# EasyEDA Pro project motorko_cryo_drake.eprj, board PCB1
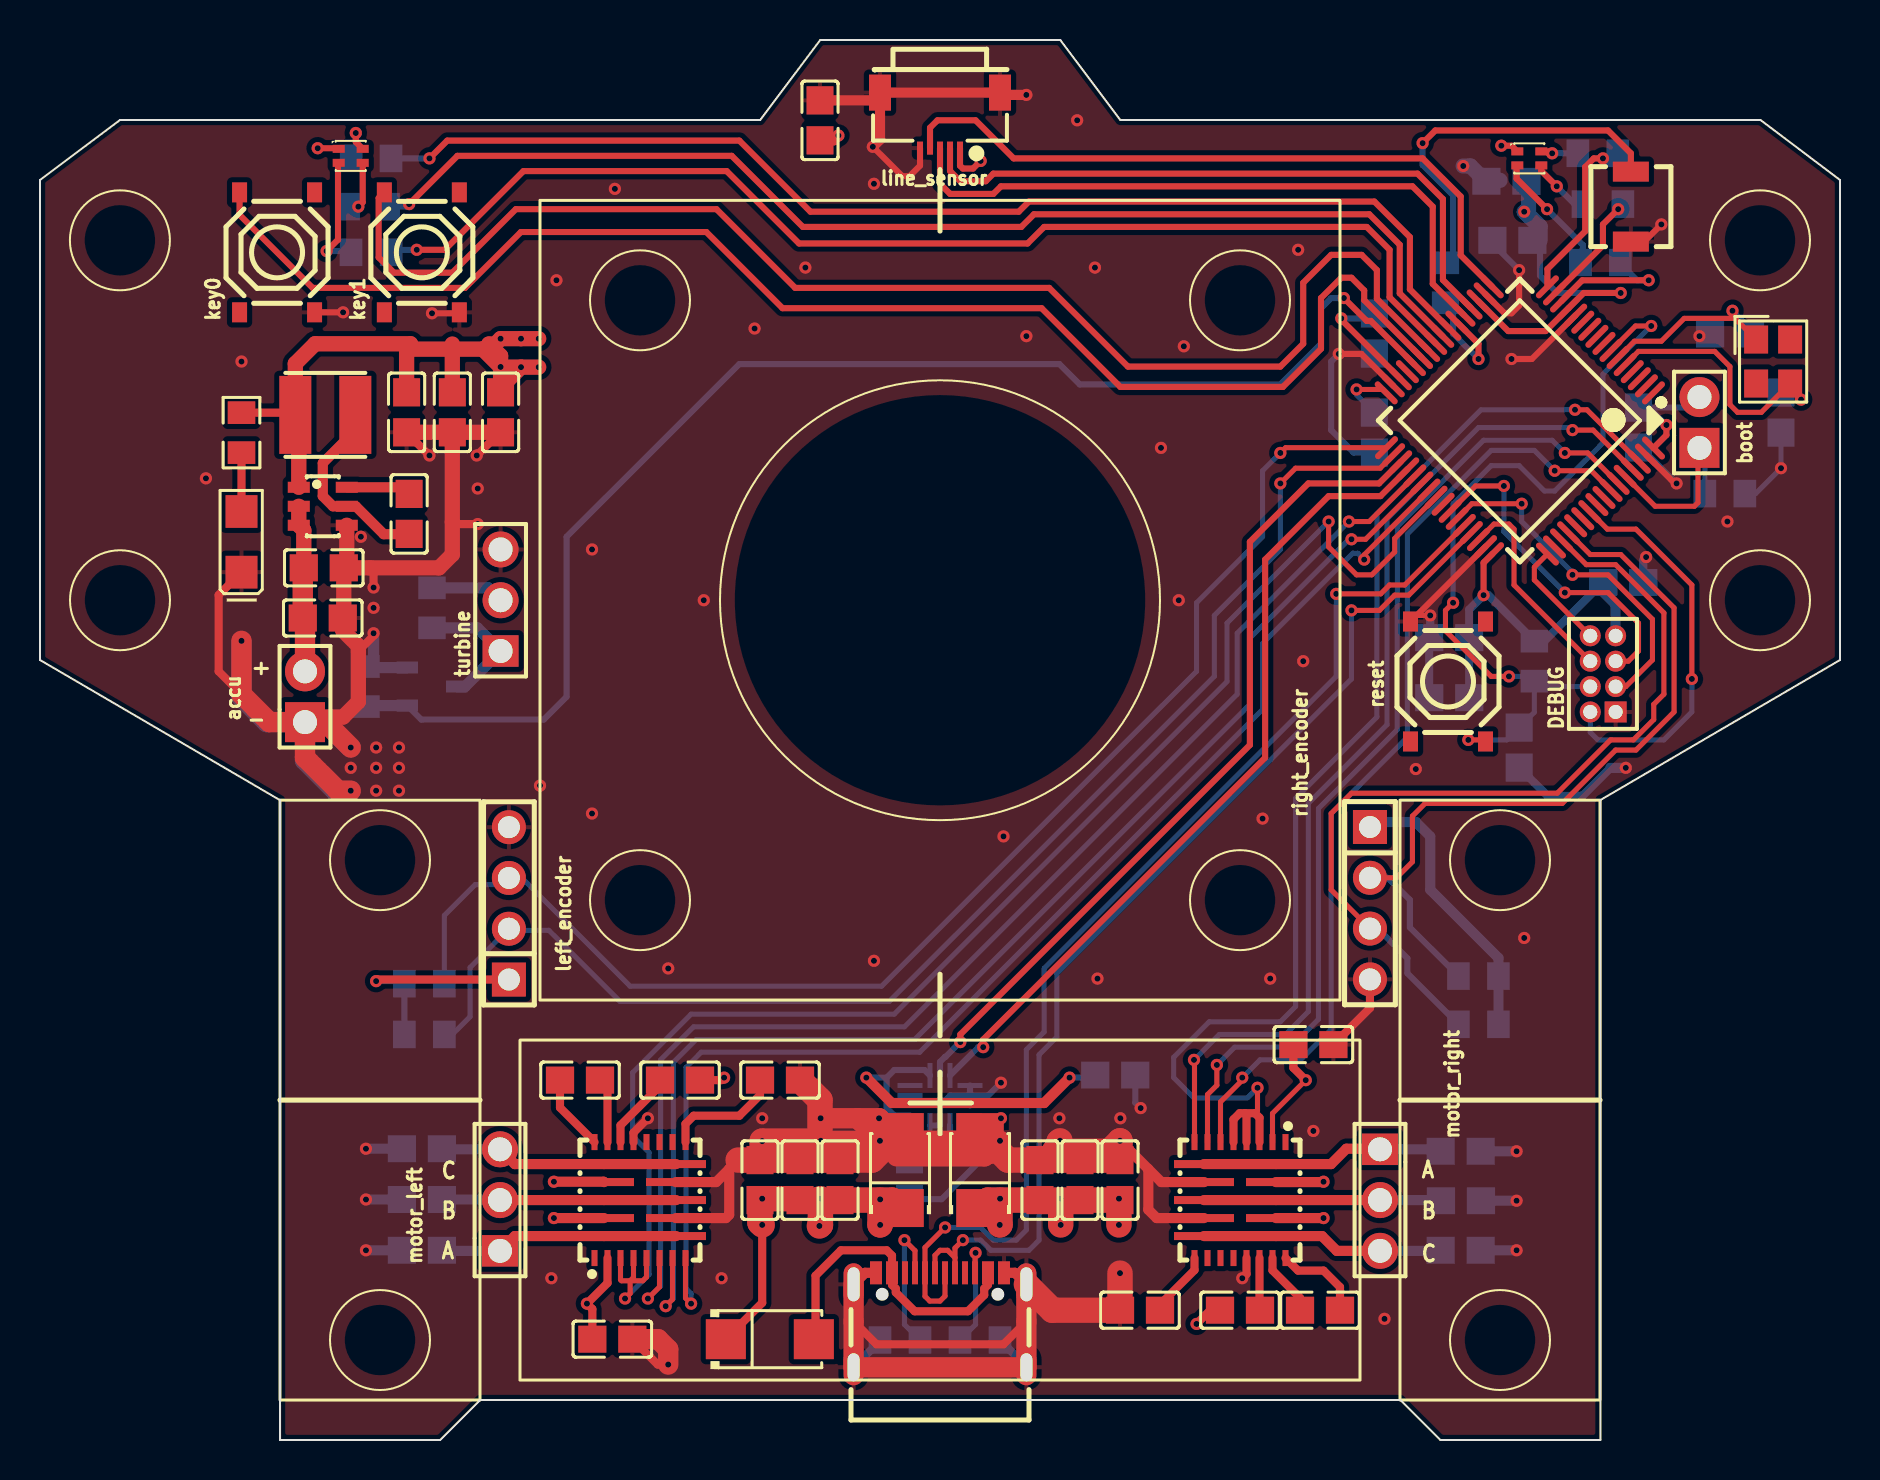
[diagram p4: board, top side]
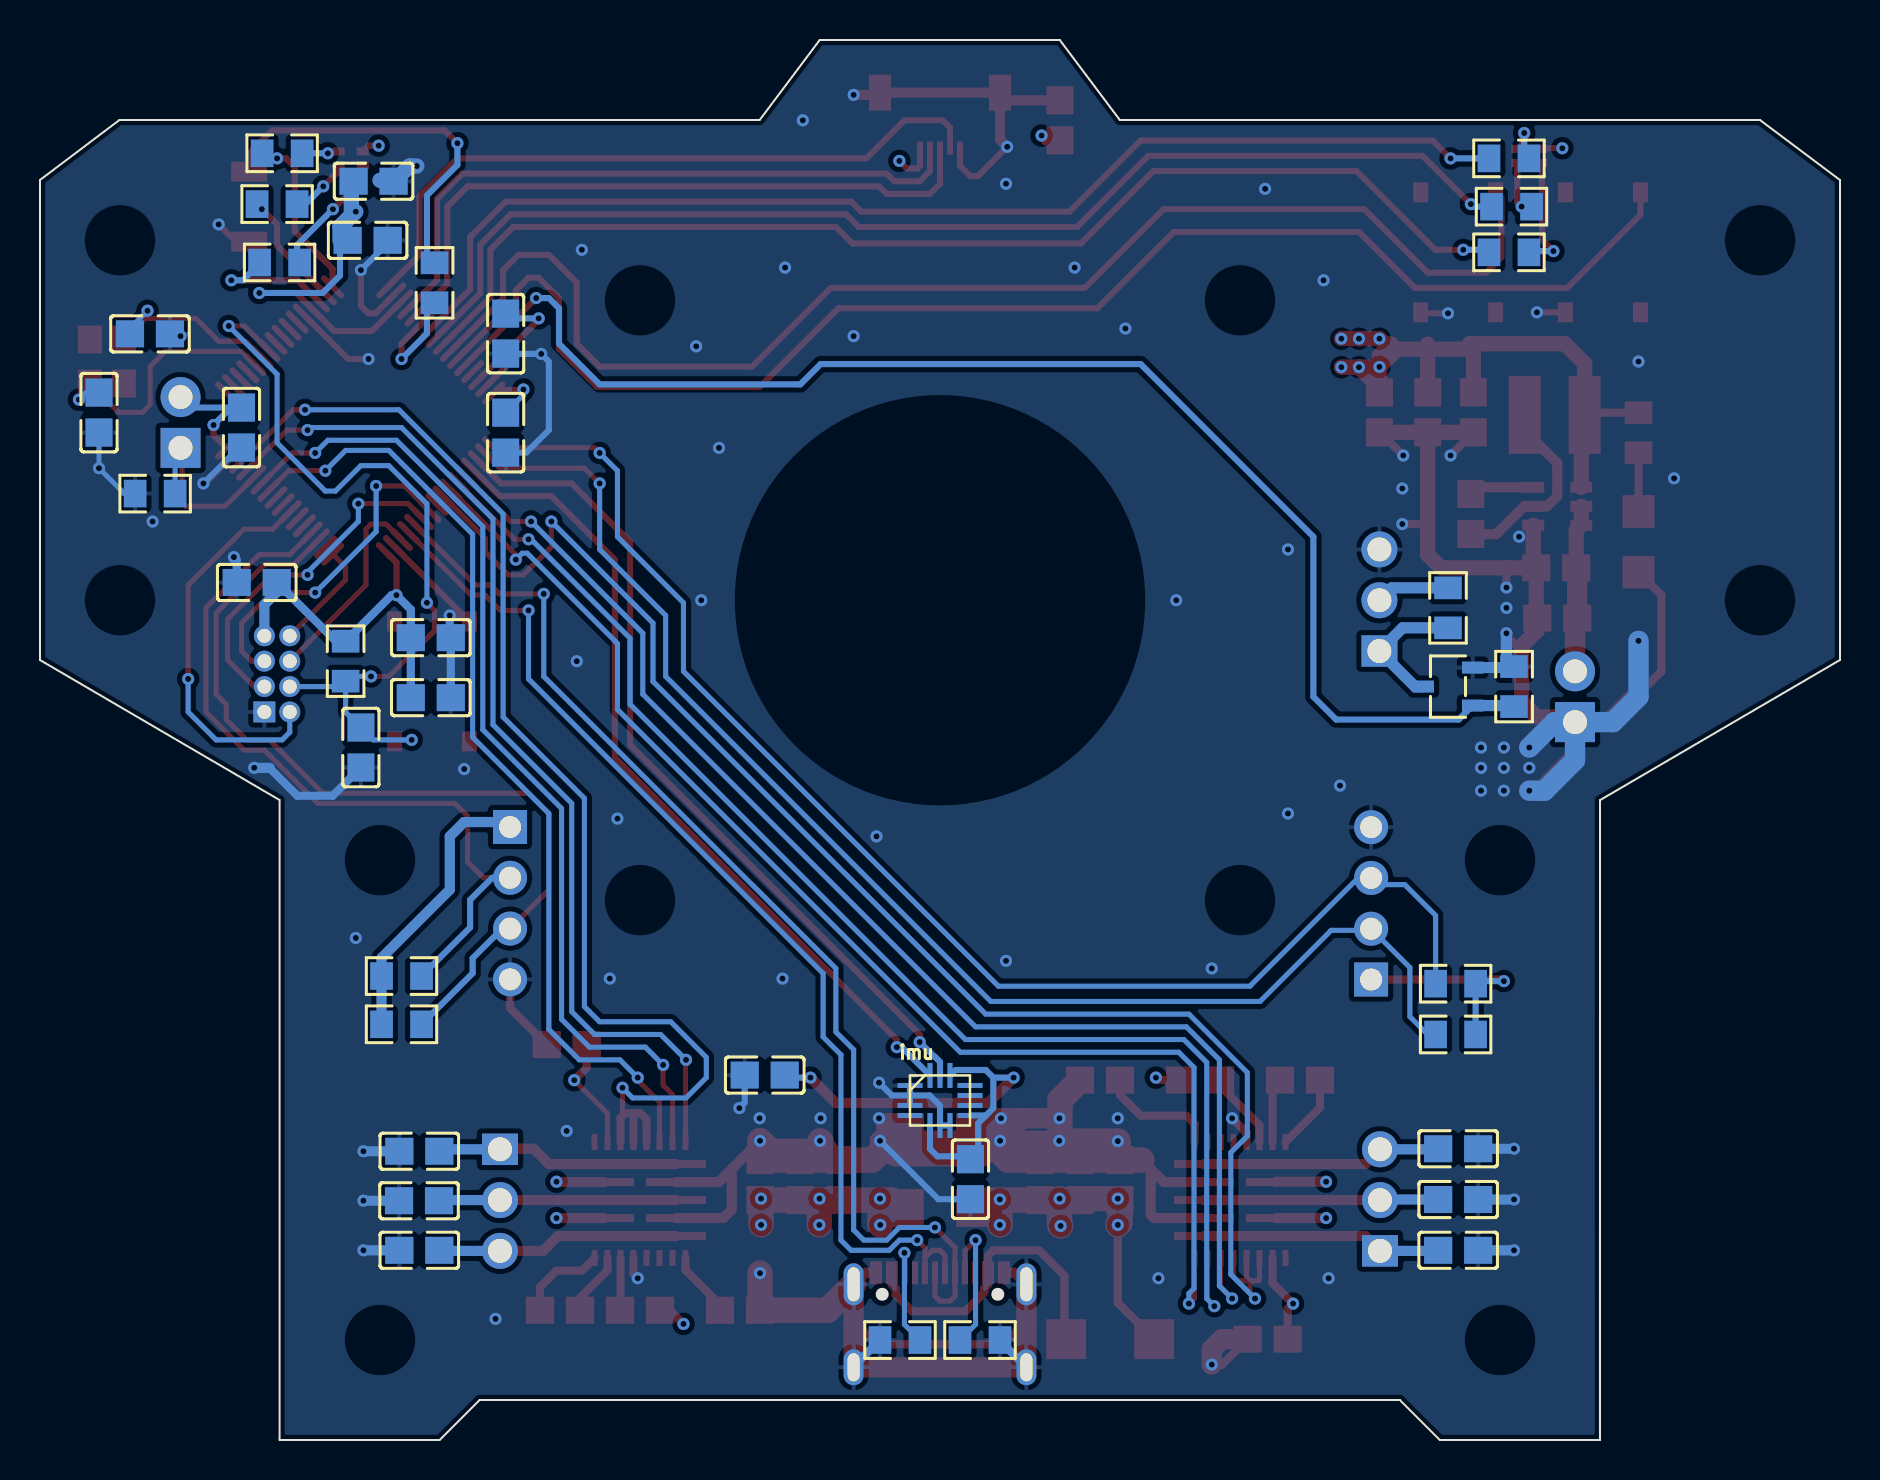
[diagram p5: board, bottom side, seen from below]

Outline 90 x 70.02 mm; copper layers: Top Layer, Inner1, Inner2, Bottom Layer. Coordinates in mm from the lower left corner of the outline.
Outline path: 0,63.02 0,39.01 12,32 12,0 20.01,0 22.01,2 68.02,2 70.02,0 78.02,0 78.02,32.01 90,39.01 90,63.02 86.02,66.02 54.01,66.02 51.01,70.02 39.01,70.02 36.01,66.02 4,66.02 0,63.02
Stack: Top Layer 0.035mm Outer layer thickness 1oz / Dielectric1 0.2104mm 7628 RC49% 8.6mil / Inner1 0.0152mm Inner layer thickness / Dielectric2 1.065mm 1.1mm H/HOZ Copper / Inner2 0.0152mm Inner layer thickness / Dielectric3 0.2104mm 7628 RC49% 8.6mil / Bottom Layer 0.035mm Outer layer thickness 1oz

## Design rules (mm)
template: JLCPCB Capability(Two Layers Board)
spacing copperThickness1oz (default): track to track 0.102, other pairs 0.152 to 0.3
spacing copperThickness2oz: track to track 0.203, other pairs 0.152 to 0.3
track width copperThickness1oz (default): min 0.127, default 0.254, max 2.54
track width copperThickness2oz: min 0.203, default 0.254, max 2.54
differential pair differentialPair (default): width min 0.127, default 0.254, max 2.54; gap min 0.152, default 0.152
via viaSize (default): diameter min 0.5, default 0.61, max 10; hole min 0.3, default 0.305, max 6.3

## Placement (name value [footprint] x y rotation side)
accu  PZ254V-11-02P  [HDR-TH_2P-P2.54-V-M]  13.25 37.17 90 top
boot  PZ254V-11-02P  [HDR-TH_2P-P2.54-V-M]  82.97 50.89 90 top
C1  100nF  [C0805]  70.46 37.13 0 bottom
C2  100nF  [C0805]  73.32 62.95 0 bottom
C3  100nF  [C0805]  79.93 50.64 90 bottom
C4  100nF  [C0805]  66.72 50.38 90 bottom
C5  100nF  [C0805]  79.16 42.89 180 bottom
C6  10uF  [C0805]  73.62 60 0 bottom
C7  10uF  [C0805]  70.46 40.13 0 bottom
C8  2.2uF  [C0805]  66.72 55.33 270 bottom
C11  100nF  [C0805]  40 13 270 top
C12  10uF  [C0805]  38 13 270 top
C13  100nF  [C0805]  27 18 0 top
C14  4.7uF  [C0805]  37 18 180 top
C15  1uF  [C0805]  32 18 180 top
C16  10uF  [C0805]  36 13 270 top
C17  100nF  [C0805]  54 13 270 top
C18  10uF  [C0805]  52 13 270 top
C19  100nF  [C0805]  64 6.49 180 top
C20  4.7uF  [C0805]  55 6.49 0 top
C21  1uF  [C0805]  60 6.49 0 top
C22  10uF  [C0805]  50 13 270 top
C62  100n  [C0805]  18.46 46.32 90 top
C63  100nF  [C0805]  18.33 51.4 90 top
C64  10uF  [C0805]  20.62 51.4 90 top
C65  10uF  [C0805]  23.03 51.4 90 top
C66  100nF  [C0805]  14.14 41.11 180 top
C67  10uF  [C0805]  14.19 43.62 180 top
C68  100nF  [C0805]  73.96 34.63 90 bottom
C69  10uF  [C0805]  39 66 270 top
C70  100nF  [C0805]  63.67 19.78 180 top
C71  100nF  [C0805]  28.62 5.04 180 top
C72  100nF  [C0805]  53.76 18.25 180 bottom
C73  100nF  [C0805]  43.48 13.04 90 bottom
C74  47uF  [CAP-SMD_L3.5-W2.8-R-RD]  47 13.5 270 top
C75  47uF  [CAP-SMD_L3.5-W2.8-R-RD]  43 13.5 270 top
C76  100pF  [C0805]  19.09 9.49 0 bottom
C77  100pF  [C0805]  19.09 12.03 0 bottom
C78  100pF  [C0805]  19.09 14.57 0 bottom
C79  100pF  [C0805]  71.03 14.44 180 bottom
C80  100pF  [C0805]  71.05 11.97 180 bottom
C81  100pF  [C0805]  71.03 9.49 180 bottom
C82  18p  [C0805]  87.05 51.38 90 bottom
C83  18p  [C0805]  84.5 55.32 0 bottom
D1  SS34  [SMA_L4.3-W2.6-LS5.2-RD]  36.49 5.04 0 top
DEBUG  PH-00742  [HDR-TH_8P-P1.27-V-M-R2-C4-S1.27]  78.15 38.32 90 top
imu  LSM6DSM  [LGA14L]  45 16.98 180 bottom
key0  TS1187A26015  [SW-SMD_4P-L5.1-W5.1-P3.70-LS6.5-TL_H1.5]  11.85 59.4 90 top
key1  TS1187A26015  [SW-SMD_4P-L5.1-W5.1-P3.70-LS6.5-TL_H1.5]  19.09 59.4 90 top
L1  4.7uH  [IND-SMD_L4.0-W4.0_FNR40XXS]  14.27 51.27 180 top
left_encoder  PZ254V-11-04P  [HDR-TH_4P-P2.54-V-M]  23.44 26.84 90 top
line_sensor  GT-F0509SR15-05SMT01  [CONN-SMD_GT-F0509SR15-05SMT01]  45 66 180 top
motor_left  2.54-1*3P针  [HDR-TH_3P-P2.54-V-M-1]  23 12 90 top
motor_right  2.54-1*3P针  [HDR-TH_3P-P2.54-V-M-1]  67 12 270 top
Q1  TSM240N03CX RFG  [SOT-23-3_L2.9-W1.6-P1.90-LS2.8-BR]  19.6 37.68 180 bottom
R1  330Ω  [R0805]  10.08 50.38 90 top
R2  4.7kΩ  [R0805]  74.72 38.95 90 bottom
R3  4.7kΩ  [R0805]  84.24 47.33 0 bottom
R4  4.7kΩ  [R0805]  16.55 59.4 0 bottom
R5  4.7kΩ  [R0805]  16.42 61.69 0 bottom
R6  4.7kΩ  [R0805]  16.55 64.1 0 bottom
R7  4.7kΩ  [R0805]  47 5 0 bottom
R8  4.7kΩ  [R0805]  43 5 180 bottom
R9  4.7kΩ  [R0805]  19.22 22.82 180 bottom
R10  4.7kΩ  [R0805]  19.22 20.28 180 bottom
R11  4.7kΩ  [R0805]  71.92 23.2 0 bottom
R12  4.7kΩ  [R0805]  71.92 20.79 0 bottom
R13  4.7kΩ  [R0805]  78.02 58.89 0 bottom
R14  4.7kΩ  [R0805]  78.15 61.81 0 bottom
R15  4.7kΩ  [R0805]  77.89 64.35 0 bottom
R16  4.7kΩ  [R0805]  19.6 41.62 90 bottom
R17  4.7kΩ  [R0805]  16.3 37.68 270 bottom
R18  22Ω  [R0805]  70.27 57.88 90 bottom
reset  TS1187A26015  [SW-SMD_4P-L5.1-W5.1-P3.70-LS6.5-TL_H1.5]  70.4 37.94 270 top
right_encoder  PZ254V-11-04P  [HDR-TH_4P-P2.54-V-M]  66.5 26.85 270 top
turbine  2.54-1*3P针  [HDR-TH_3P-P2.54-V-M-1]  23.03 42 90 top
U1  STM32F722RET6TR  [LQFP-64_L10.0-W10.0-P0.50-LS12.0-BL]  74 51 135 top
U4  CLMUD-FKC-CH1NP1561BB7T4S3  [LED-SMD_4P-L1.5-W1.5_CLMUD-FKC-CH1NP1561BB7T4S3]  15.54 64.22 0 top
U5  CLMUD-FKC-CH1NP1561BB7T4S3  [LED-SMD_4P-L1.5-W1.5_CLMUD-FKC-CH1NP1561BB7T4S3]  74.46 64.1 0 top
U8  MP6541GQKT-Z  [QFN-26_L6.0-W6.0-P0.65-TL_MP6541]  30 12 90 top
U9  MP6541GQKT-Z  [QFN-26_L6.0-W6.0-P0.65-TL_MP6541]  60 12 270 top
U16  AP63203WU-7  [TSOT-26_L2.9-W1.6-P0.95-LS2.8-BL]  14.14 46.7 270 top
U17  YLED1206G  [LED1206-RD]  10.08 44.92 90 top
U18  4kHz  [BUZ-SMD_L4.0-W4.0-P3.50-L]  79.54 61.69 270 top
USB1  TYPE-C16PIN  [USB-C-SMD_TYPE-C16PIN]  45 6 0 top
X1  12MHz  [CRYSTAL-SMD_4P-L3.2-W2.5-BL]  86.66 53.94 270 top

## Footprints (pads in the part's own frame, mm; a bottom-side part is the same pattern mirrored in y, then rotated)
BUZ-SMD_L4.0-W4.0-P3.50-L
  rect 1x1.8 smd: 1(-1.75,0) 2(1.75,0)
C0805
  rect 1.41x1.35 smd: 1(-1,0) 2(1,0)
CAP-SMD_L3.5-W2.8-R-RD
  rect 1.9x2.376 smd: 1(1.899,0) 2(-1.899,0)
CONN-SMD_GT-F0509SR15-05SMT01
  rect 0.3x0.65 smd: 1(-1,1.387) 2(-0.5,1.387) 3(-0.001,1.387) 4(0.499,1.387) 5(1,1.387)
  rect 1.1x1.8 smd: 6(3,-1.387) 7(-3,-1.387)
CRYSTAL-SMD_4P-L3.2-W2.5-BL
  rect 1.4x1.2 smd: 1(-1.1,-0.85) 2(1.1,-0.85) 3(1.1,0.85) 4(-1.1,0.85)
HDR-TH_2P-P2.54-V-M
  rect 2x2 hole 1.2: 1(-1.27,0)
  round 2 hole 1.2: 2(1.27,0)
HDR-TH_3P-P2.54-V-M-1
  rect 1.575x1.8 hole 1.2: 1(-2.54,0)
  round 1.8 hole 1.2: 2(0,0) 3(2.54,0)
HDR-TH_4P-P2.54-V-M
  rect 1.7x1.7 hole 1.1: 1(-3.81,0)
  round 1.7 hole 1.1: 2(-1.27,0) 3(1.27,0) 4(3.81,0)
HDR-TH_8P-P1.27-V-M-R2-C4-S1.27
  rect 1.05x1.1 hole 0.7: 1(-1.905,-0.635)
  round 1.05 hole 0.7: 2(-1.905,0.635) 3(-0.635,-0.635) 4(-0.635,0.635) 5(0.635,-0.635) 6(0.635,0.635) 7(1.905,-0.635) 8(1.905,0.635)
IND-SMD_L4.0-W4.0_FNR40XXS
  rect 1.6x3.9 smd: 1(-1.5,0) 2(1.5,0)
LED1206-RD
  rect 1.635x1.6 smd: 1(-1.518,0) 2(1.518,0)
LED-SMD_4P-L1.5-W1.5_CLMUD-FKC-CH1NP1561BB7T4S3
  rect 0.6x0.4 smd: 1(-0.6,0.35) 2(-0.6,-0.35) 3(0.6,-0.35) 4(0.6,0.35)
LGA14L
  rect 1.25x0.25 smd: P$1(-1.5,0.75) P$2(-1.5,0.25) P$3(-1.5,-0.25) P$4(-1.5,-0.75) P$8(1.5,-0.75) P$9(1.5,-0.25) P$10(1.5,0.25) P$11(1.5,0.75)
  rect 0.25x1.25 smd: P$5(-0.5,-1.25) P$6(0,-1.25) P$7(0.5,-1.25) P$12(0.5,1.25) P$13(0,1.25) P$14(-0.5,1.25)
LQFP-64_L10.0-W10.0-P0.50-LS12.0-BL
  oval 0.3x1.5 smd: 1(-3.75,-5.688) 2(-3.25,-5.688) 3(-2.75,-5.688) 4(-2.25,-5.688) 5(-1.75,-5.688) 6(-1.25,-5.688) 7(-0.75,-5.688) 8(-0.25,-5.688) 9(0.25,-5.688) 10(0.75,-5.688) 11(1.25,-5.688) 12(1.75,-5.688) 13(2.25,-5.688) 14(2.75,-5.688) 15(3.25,-5.688) 16(3.75,-5.688) 33(3.75,5.688) 34(3.25,5.688) 35(2.75,5.688) 36(2.25,5.688) 37(1.75,5.688) 38(1.25,5.688) 39(0.75,5.688) 40(0.25,5.688) 41(-0.25,5.688) 42(-0.75,5.688) 43(-1.25,5.688) 44(-1.75,5.688) 45(-2.25,5.688) 46(-2.75,5.688) 47(-3.25,5.688) 48(-3.75,5.688)
  oval 1.5x0.3 smd: 17(5.7,-3.738) 18(5.7,-3.238) 19(5.7,-2.738) 20(5.7,-2.238) 21(5.7,-1.738) 22(5.7,-1.238) 23(5.7,-0.739) 24(5.7,-0.238) 25(5.7,0.262) 26(5.7,0.762) 27(5.7,1.262) 28(5.7,1.762) 29(5.7,2.261) 30(5.7,2.762) 31(5.7,3.261) 32(5.7,3.762) 49(-5.7,3.762) 50(-5.7,3.261) 51(-5.7,2.762) 52(-5.7,2.261) 53(-5.7,1.762) 54(-5.7,1.262) 55(-5.7,0.762) 56(-5.7,0.262) 57(-5.7,-0.238) 58(-5.7,-0.739) 59(-5.7,-1.238) 60(-5.7,-1.738) 61(-5.7,-2.238) 62(-5.7,-2.738) 63(-5.7,-3.238) 64(-5.7,-3.738)
QFN-26_L6.0-W6.0-P0.65-TL_MP6541
  rect 0.8x0.3 smd: 1(-2.9,2.275) 2(-2.9,1.625) 3(-2.9,0.975) 4(-2.9,0.325) 5(-2.9,-0.325) 6(-2.9,-0.975) 7(-2.9,-1.625) 8(-2.9,-2.275) 14(2.9,-2.275) 15(2.9,-1.625) 16(2.9,-0.975) 17(2.9,-0.325) 18(2.9,0.325) 19(2.9,0.975) 20(2.9,1.625) 21(2.9,2.275)
  rect 0.4x3 smd: 9(-1.8,-1.8) 10(-0.9,-1.8) 11(0,-1.8) 12(0.9,-1.8) 13(1.8,-1.8) 22(1.8,1.8) 23(0.9,1.8) 24(0,1.8) 25(-0.9,1.8) 26(-1.8,1.8)
R0805
  rect 1.133x1.377 smd: 1(-1,0) 2(1,0)
SMA_L4.3-W2.6-LS5.2-RD
  rect 2x2 smd: 1(-2.2,0) 2(2.2,0)
SOT-23-3_L2.9-W1.6-P1.90-LS2.8-BR
  rect 1.07x0.6 smd: 1(1.235,-0.95) 2(1.235,0.95) 3(-1.235,0)
SW-SMD_4P-L5.1-W5.1-P3.70-LS6.5-TL_H1.5
  rect 1x0.75 smd: 1(-3,1.875) 2(3,1.875) 3(-3,-1.875) 4(3,-1.875)
TSOT-26_L2.9-W1.6-P0.95-LS2.8-BL
  rect 0.55x1.1 smd: 1(-0.95,-1.2) 2(0,-1.2) 3(0.95,-1.2) 4(0.95,1.2) 5(0,1.2) 6(-0.95,1.2)
USB-C-SMD_TYPE-C16PIN
  oval 1x2.1 hole 0.6x1.7: 1(-4.32,1.788) 2(4.32,1.788)
  oval 1x1.8 hole 0.6x1.4: 3(-4.32,-2.362) 4(4.32,-2.362)
  rect 0.6x1.15 smd: A1B12(-3.2,2.362) A4B9(-2.4,2.362) B1A12(3.2,2.362) B4A9(2.4,2.362)
  rect 0.3x1.15 smd: A5(-1.25,2.362) A6(-0.25,2.362) A7(0.25,2.362) A8(1.25,2.362) B5(1.75,2.362) B6(0.75,2.362) B7(-0.75,2.362) B8(-1.75,2.362)

## Nets
As in the schematic.

Pads without a net: imu P$4 P$9 P$10 P$11; key0 1 4; key1 1 4; reset 1 4; U1 1 2 3 4 8 9 29 41 50 53 54 56 57; U8 1 15 16 17; U9 1 15 16 17; USB1 A8 B8; X1 2 4

## Via types
v1: diameter 0.61, hole 0.305, Top Layer to Bottom Layer, 180 vias

## Routing (per net, layer and track width the routed paths; a pad name or vN(x,y) marks a point on that pad's centre or on a via; arc(x,y) is an arc through that point)
+3V3: length 467.3
  Top Layer w0.254: U1.32 67.14,52.54 v1(65.83,52.54) ; U9.2 61.62,16.33 v1(63.29,18)
  Top Layer w0.305: 14.94,64.58 14.91,64.61 v1(13.89,64.61) ; v1(72.18,42.25) 72.18,43.87 U1.48 ; v1(73.07,64.73) 73.58,64.73 U5.1 ; v1(79.04,57.37) 77.19,57.37 75.28,55.46 73.41,55.46 71.91,56.97 ; line_sensor.1 46,63.73 46.14,63.59 46.65,63.59 v1(47.03,63.97) ; U1.64 81.32,50.26 v1(81.32,50.76)
  Top Layer w0.406: v1(16.81,22.95) 16.89,23.03 left_encoder.1 ; C70.2 62.67,18.62 v1(63.29,18) ; 12.66,51.38 R1.2 ; C71.2 27.62,6.55 v1(27.35,6.82) 28.38,7.85 U8.2
  Top Layer w0.508: C69.2 39.68,65 v1(39.92,65.24) ; v1(41.32,18.12) 42.59,16.85 50.21,16.85 v1(51.48,18.12)
  Top Layer w0.762: v1(23.03,53.67) 23.03,54.22 22.44,54.81 22.76,54.81 v1(23.03,55.08) v1(24.05,55.08) v1(24.93,55.08) ; v1(23.03,53.67) 23.04,53.66 v1(24.05,53.66) ; v1(23.03,53.67) 22.14,54.56 ; v1(23.03,53.67) 23.03,52.64 ; 18.33,54.63 18.41,54.56 20.62,54.56 ; 18.33,54.63 C63.2 ; 18.33,54.63 18.52,54.83 13.76,54.83 12.77,53.83 L1.2 ; v1(24.05,53.66) v1(24.93,53.66) ; v1(24.05,53.66) 23.03,52.64 ; 23.03,52.64 C65.2 ; 20.64,54.56 20.62,54.56 ; 20.64,54.56 20.62,54.54 ; 20.64,54.56 22.14,54.56 ; 20.62,54.56 20.62,54.54 ; 20.62,54.56 20.62,54.81 ; 20.62,54.54 C64.2 ; 22.14,54.56 22.14,54.57 ; U16.1 12.94,51.1
  Inner2 w0.305: v1(13.89,64.61) 12.61,63.34 12.61,59.53 14.77,57.37 20.74,57.37 v1(23.03,55.08) ; 70.51,61.43 70.4,61.54 70.4,63.97 71.16,64.73 v1(73.07,64.73)
  Inner2 w0.406: v1(16.81,22.95) 15.66,22.95 ; v1(27.35,6.82) 27.35,5.97
  Inner2 w0.508: right_encoder.1 64.69,28.84 64.69,23.08 62.91,21.3 54.65,21.3 v1(51.48,18.12) ; v1(39.92,65.24) 40.68,66 45,66 v1(47.03,63.97)
  Inner2 w0.559: 54.82,61.43 54.82,55.67 59.1,51.4 59.1,38.06 right_encoder.1 ; v1(63.29,18) 67.48,18 70.4,15.08 70.4,7.46 67.35,4.41 55.92,4.41 55.29,5.04 28.27,5.04 27.38,5.93 22.9,5.93 18.08,10.76 18.08,20.54 13.89,24.73 13.89,31.84 9.31,36.41 9.31,41.36 v1(23.03,55.08) ; 74.21,61.3 74.08,61.43
  Inner2 w0.762: 68.6,52.69 68.44,52.54 v1(65.83,52.54) ; 68.6,52.69 68.6,45.84 v1(72.18,42.25) ; 68.6,52.69 69,53.1 69,61.16 69.27,61.43 ; 38.52,63.84 v1(39.92,65.24) ; v1(81.32,50.76) 79.67,50.76 75.23,55.21 75.23,60.29 74.21,61.3 v1(74.21,61.43)
  Inner2 w1.27: 74.08,61.43 40.94,61.43 38.52,63.84 28.11,63.84 23.03,58.76 v1(23.03,55.08) ; v1(23.03,55.08) v1(24.05,55.08) v1(24.93,55.08) ; v1(23.03,55.08) v1(23.03,53.67) 23.04,53.66 v1(24.05,53.66) v1(24.93,53.66)
  Bottom Layer w0.254: v1(65.83,52.54) 65.83,52.27 C4.2
  Bottom Layer w0.305: v1(16.81,22.95) 18.09,22.95 R9.2 R10.2 ; boot.2 82.45,51.64 80.45,51.64 ; v1(51.48,18.12) 52.64,18.12 C72.2 ; imu.P$8 42.7,16.23 ; 42.7,16.23 42.33,16.6 42.33,18.12 ; 42.7,16.23 43.09,15.84 43.09,14.69 43.6,14.19 45.13,14.19 45.5,14.56 imu.P$5 ; 42.33,18.12 42.71,18.5 44.23,18.5 imu.P$12 ; 42.33,18.12 v1(41.32,18.12) ; v1(79.04,57.37) 75.87,57.37 75,58.24 75,60 ; C3.2 80.45,51.64 ; 80.45,51.64 v1(81.32,50.76)
  Bottom Layer w0.406: 78.15,42.89 75.21,39.95 R2.2 72.42,42.25 v1(72.18,42.25) 71.46,41.54 C7.2 C1.2
  Bottom Layer w0.508: 78.15,42.89 C5.2 ; R12.2 R11.2 72.92,24.11 69.51,27.52 69.51,30.19 68.79,30.91 66.75,30.91 right_encoder.1 ; DEBUG.7 78.78,41.78 77.91,42.65
  Bottom Layer w0.762: 75,60.7 74.94,60.7 v1(74.21,61.43) ; 75,60.7 75,60 ; 75,60.7 74.43,61.27 74.43,62.85 C2.2
GND: length 751.8
  Top Layer w0.254: v1(69.51,41.24) 68.83,41.24 reset.3
  Top Layer w0.305: U1.63 81.74,47.84 v1(81.83,47.84) ; U1.12 74.59,54.06 v1(73.57,54.06) ; U18.2 80.21,59.94 v1(81.07,60.8) ; key0.3 v1(15.16,56.4) ; v1(64.94,54.32) 66.07,54.32 U1.31 ; v1(73.96,58.51) 73.96,56.73 73.57,56.35 73.23,56.35 U1.18 ; v1(19.6,56.35) 20.92,56.35 key1.3 ; v1(41.64,64.68) 43.11,63.21 43.48,63.21 44,63.73 line_sensor.5 ; U1.47 68.83,41.24
  Top Layer w0.406: 49.32,5.93 48.18,4.79 41.82,4.79 40.68,5.93 ; C70.1 66.5,21.6 right_encoder.4 ; 16.5,43.62 16.68,43.45 v1(16.68,42.64) ; U9.18 60.32,8.3 v1(60.11,8.09) ; C71.1 30.89,3.77 v1(31.41,3.77) ; 15.92,39.46 16.68,40.23 v1(16.68,40.35) ; v1(21.89,45.81) 20.7,45.81 20.62,45.9 ; U8.18 29.68,15.37 v1(30.4,16.09) ; 10.08,37.3 8.93,38.44 8.93,42.26 U17.1 ; C63.1 18.33,50.38 v1(19.47,49.24) ; v1(21.84,49.24) 23,50.4
  Top Layer w0.508: USB1.B1A12 48.75,8.36 USB1.2 ; U9.12 55.83,11.1 55.41,11.52 55.41,13.55 ; 34.91,14 34.46,13.55 ; 34.46,13.55 33.81,12.9 U8.12 ; 34.46,13.55 34.46,11.27 34.29,11.1 U8.10 ; v1(41.64,64.68) 42,65.03 line_sensor.6 ; USB1.A1B12 41.25,8.36 USB1.1 ; 55.41,13.55 56.07,12.9 U9.10 ; 55.41,13.55 54.48,14.48 ; v1(49.32,67.27) 48.11,67.27 line_sensor.7 line_sensor.6 ; line_sensor.6 41.61,67 C69.1
  Top Layer w0.762: accu.1 13.5,36.16 15.16,36.16 15.92,36.92 15.92,39.71 15.14,40.49 C66.1 15.19,41.16 C67.1 ; C65.1 C64.1 ; C67.1 15.34,43.77 U16.4 ; C67.1 19.95,43.62 20.62,44.29 C64.1 ; C64.1 C63.1
  Top Layer w1.016: accu.1 11.47,35.9 10.08,37.3 v1(10.08,39.97) ; accu.1 14.27,35.9 v1(15.54,34.63) ; accu.1 13.25,34.13 14.9,32.47 v1(15.54,32.47) ; 40.87,16.09 v1(42,14.96) ; 40.87,16.09 v1(39.03,16.09) ; 40.87,16.09 v1(41.95,16.09) 42,16.05 42,15.03 ; v1(42,14.96) v1(39.04,14.96) ; v1(42,14.96) v1(48,14.96) 47.54,14.5 ; v1(42,14.96) 42,15.03 ; USB1.2 USB1.4 USB1.3 USB1.1 ; 42.84,14.19 47.22,14.19 47.54,14.5 ; 47.54,14.5 47.54,14.31 ; 42,15.03 41.44,15.58 ; v1(31.41,3.77) 31.41,4.53 30.9,5.04 C71.1
  Top Layer w1.27: C75.2 41.6,14 C11.1 39,14 ; 39,14.95 39,14 ; 39,14.95 39.03,14.95 v1(39.04,14.96) ; 39,14.95 39,17 C14.1 ; 39,14.95 v1(36.11,14.95) 36.11,14.11 C16.1 ; 39,14 C12.1 C16.1 ; C16.1 34.91,14 ; C74.2 48.4,14 C22.1 50.95,14 ; 50.95,14.44 50.95,14.91 v1(51,14.96) ; 50.95,14.44 53.48,14.44 v1(54,14.96) C17.1 C18.1 50.95,14 ; 50.95,14.44 50.95,14 ; 50.95,14.44 50.72,14.44 ; 54,7 v1(54,8.34) ; C20.1 50.62,6.49 USB1.2 ; 42,14.96 v1(42,14.96)
  Inner1 w0.254: 17.93,35.9 17.95,35.89 v1(17.95,34.63) v1(17.95,33.62) v1(17.95,32.47) ; v1(15.54,32.47) v1(15.54,33.62) v1(15.54,34.63) 15.61,34.71 15.61,35.9 ; v1(42,14.96) 41.95,15.01 v1(41.95,16.09) ; v1(87.05,48.6) 84.35,48.6 84.09,48.34 82.33,48.34 v1(81.83,47.84) ; v1(54.02,16.09) 54.02,14.98 v1(54,14.96) ; v1(39.04,14.96) 39.03,14.97 39.03,15.33 ; v1(36.11,16.09) v1(36.11,14.95) ; 16.77,35.9 16.81,35.87 v1(16.81,34.63) v1(16.81,33.62) v1(16.81,32.47) ; v1(48.05,16.09) 48.05,15.01 v1(48,14.96) ; 79.36,50.45 79.36,51.59 v1(82.97,55.21) ; v1(50.97,16.09) 50.97,14.99
  Inner1 w0.305: v1(73.96,58.51) 78.78,58.51 v1(81.07,60.8) ; 21.84,56.16 19.79,56.16 v1(19.6,56.35) ; 74.79,55.02 74.53,55.02 v1(73.57,54.06) ; 21.84,54.59 21.44,54.19 16.42,54.19 15.16,55.46 v1(15.16,56.4) ; v1(48.05,16.09) v1(48.05,17.87) 48.56,17.36 50.59,17.36 51.35,16.6 v1(55.03,16.6)
  Inner1 w0.406: v1(31.41,3.77) 36.85,9.21 38.29,9.21 ; 54.25,8.09 v1(60.11,8.09)
  Inner1 w0.508: v1(16.04,45.17) 16.04,44.58 16.01,44.54 ; v1(80.31,44.16) 81.19,43.27 81.19,35.4 80.75,34.95 80.24,34.95 79.42,35.78 ; v1(73.83,9.49) 73.83,10.38 ; 73.83,10.38 v1(73.83,11.97) v1(73.83,14.44) ; 73.83,10.38 69.89,6.44 68.88,6.44 67.99,7.33 55.02,7.33 54.25,8.09 ; v1(16.3,9.49) v1(16.3,12.03) v1(16.3,14.57) 16.3,16.85 20.74,21.3 ; 79.42,35.4 79.42,35.78 ; 79.42,35.78 DEBUG.1 ; 77.38,33.36 76.62,32.6 76.62,21.43 74.08,18.89 70.65,18.89 68.68,20.86 ; v1(79.29,33.62) 79.29,35.27
  Inner1 w0.762: USB1.2 USB1.4 ; 41.19,64.22 28.49,64.22 21.84,57.57 v1(21.84,49.24) 20.23,47.64 20.23,44.54 ; 41.19,64.22 v1(41.64,64.68) ; 41.19,64.22 42.59,64.22 44.37,66 50.46,66 52.75,63.72 68.76,63.72 ; 68.76,63.72 68.76,61.05 ; 68.76,63.72 v1(71.16,63.72) ; 68.76,61.05 71.48,58.32 ; 68.76,61.05 68.76,58.14 v1(64.94,54.32) 64.94,48.86 69,44.79 69,42.13 ; turbine.3 20.23,44.54 ; 20.23,44.54 12.49,44.54 11.09,43.14 11.09,37.43 12.93,35.59 ; 71.48,58.32 73.77,58.32 v1(73.96,58.51) ; 71.48,58.32 74.79,55.02 81.83,47.98 v1(81.83,47.84) ; USB1.3 USB1.1 39.72,7.79 37.47,10.03 37.47,15.33 ; 79.42,35.4 77.38,33.36 70.53,33.36 70.33,33.56 ; v1(68.79,33.56) 70.33,33.56 ; 70.33,33.56 68.75,35.14 68.75,41.75 ; 69,41.75 v1(69.51,41.24)
  Inner1 w1.016: v1(27.6,44.54) turbine.3 23.03,44.67 ; 37.47,10.03 37.47,5.08 38.91,3.64 USB1.3 USB1.4 51.21,3.64 54,6.42 v1(54,8.34) 53.44,7.79 USB1.2 48.78,7.79 48.3,8.27 41.7,8.27 41.22,7.79 USB1.1 ; left_encoder.4 20.74,30.65 ; 23.03,44.67 23.03,46.44 v1(21.89,47.59) ; 23.03,44.67 v1(21.89,45.81) ; v1(15.54,32.47) 15.16,32.47 13.25,34.38 accu.1 11.47,35.9 10.08,37.3 v1(10.08,39.97) ; 68.68,20.86 right_encoder.4
  Inner1 w1.27: v1(27.6,31.33) 26.92,30.65 left_encoder.4 ; 40.68,15.33 26.71,15.33 20.74,21.3 20.74,34.25 19.09,35.9 accu.1 ; v1(54,8.34) 52.49,9.85 52.49,13.47 v1(51,14.96) ; v1(54,14.96) v1(51,14.96) ; v1(51,14.96) v1(48,14.96) v1(42,14.96) 40.68,14.96
  Bottom Layer w0.254: v1(82.97,55.21) 83.39,55.21 C83.1 ; C82.1 v1(87.05,48.6) 85.78,47.33 R3.2
  Bottom Layer w0.305: 73,60 73,59.47 v1(73.96,58.51) ; v1(81.83,47.84) 80.04,49.64 C3.1 ; C72.1 54.76,16.87 v1(55.03,16.6) ; C8.2 66.7,54.32 v1(64.94,54.32) 64.56,53.94 64.56,50.51 65.69,49.38 C4.1 ; imu.P$2 imu.P$3 ; imu.P$2 imu.P$1 ; imu.P$2 45.5,17.23 45,16.73 imu.P$6 imu.P$7 ; imu.P$2 47.41,17.23 v1(48.05,17.87) ; v1(48,14.96) 45.08,12.04 C73.1
  Bottom Layer w0.406: USB1.4 49.32,3.68 R7.2 ; USB1.3 42,4.96 R8.2 ; C5.1 80.16,44.02 v1(80.31,44.16) ; v1(69.51,41.24) 69.51,40.18 C7.1 C1.1 ; 78.52,33.61 77.13,32.22 75.37,32.22 C68.1
  Bottom Layer w0.508: C77.1 v1(16.3,12.03) ; C79.1 v1(73.83,14.44) ; C78.1 v1(16.3,14.57) ; C76.1 v1(16.3,9.49) ; C80.1 v1(73.83,11.97) ; C81.1 v1(73.83,9.49) ; v1(79.29,33.62) 78.51,33.62
  Bottom Layer w0.559: v1(16.68,40.35) 16.68,39.06 R17.1 16.35,38.63 Q1.2
  Bottom Layer w0.762: v1(71.16,63.72) 71.52,63.72 72.24,63 73,63
  Bottom Layer w1.016: v1(10.08,39.97) 10.08,37.17 11.34,35.9 accu.1 ; v1(15.54,32.47) 14.77,32.47 13.25,34 accu.1 ; v1(15.54,34.63) 14.27,35.9 accu.1
  vias: v1(8.3,48.1) v1(10.08,53.94) v1(16.68,41.62) v1(25,32.73) v1(25.57,8.09) v1(25.82,58) v1(28.74,62.57) v1(31.41,23.58) v1(33.19,42) v1(34.08,8.09) v1(35.73,55.59) v1(38.27,58.64) v1(41.7,62.83) v1(41.7,23.97) v1(48.18,30.19) v1(49.32,55.21) v1(51.86,66) v1(52.75,58.64) v1(52.87,23.08) v1(56.05,49.62) v1(56.94,42) v1(57.19,54.7) v1(61.13,31.08) v1(61.51,23.08) v1(62.91,59.53) v1(63.16,38.95) v1(63.67,15.46) v1(67.22,6.06) v1(74.21,25.11) v1(84.37,45.94)
VBAT: length 176.3
  Top Layer w0.406: v1(36.11,10.76) 36.11,6.86 D1.1 ; C21.1 58.51,6.49 v1(57.83,5.81) ; C15.1 34.08,18 v1(34.21,18.12)
  Top Layer w0.508: U8.25 v1(25.7,11.1) ; U8.23 28.18,12.92 v1(25.7,12.92) ; v1(64.18,12.92) 64.16,12.9 U9.25 ; U9.23 v1(64.18,11.1)
  Top Layer w0.762: U16.2 U16.3 13.19,45.5 C67.2
  Top Layer w1.016: C67.2 13.14,43.57 C66.2 ; 13.14,41 C66.2 ; C66.2 13.25,41 accu.2
  Top Layer w1.27: v1(39.02,12.07) 39.02,12 ; 39.02,12 C12.2 37.93,12.07 v1(36.11,12.07) ; 39.02,12 39.02,10.76 v1(38.97,10.71) ; 51,12 C18.2 C17.2 53.95,11.95 v1(53.95,10.76) ; 51,12 51.04,11.96 v1(51.04,10.76) ; 51,12 C22.2 47.4,12 C74.1 ; 42,12 42,10.77 v1(42.01,10.76) ; v1(47.99,10.76) 48,10.77 48,12 ; v1(36.11,10.76) 36,10.87 C16.2 ; C75.1 42.6,12 C11.2
  Inner2 w0.406: 58.98,12.07 57.83,10.92 v1(57.83,5.81) ; v1(34.21,18.12) 34.21,13.28 33.12,12.2
  Inner2 w0.762: turbine.2 20.87,42 17.06,38.19
  Inner2 w1.27: v1(53.95,10.76) 53.95,10.76 v1(53.95,12.07) ; v1(39.02,12.07) 39.02,10.76 v1(38.97,10.71) ; v1(51.04,10.76) 51.04,12.06 v1(51.02,12.07) ; v1(36.11,10.76) v1(36.11,12.07) ; 42.05,12.07 v1(42.01,12.03) v1(42.01,10.76) ; v1(47.99,10.76) 48,10.77 v1(48,12.07)
  Inner2 w1.524: v1(25.7,11.1) v1(25.7,12.92) 26.54,12.07 33,12.07 ; v1(39.02,12.07) v1(48,12.07) v1(51.02,12.07) v1(53.95,12.07) 63.33,12.07 v1(64.18,12.92) v1(64.18,11.1) ; 39.02,12.07 v1(36.11,12.07) 33.27,12.07
  Inner2 w2.032: 44.62,12.54 44.62,17.36 41.82,20.16 21.89,20.16 20.44,21.6 20.44,35.4 17.4,38.44 accu.2
  Bottom Layer w0.559: R16.2 22.41,42.62 turbine.2
VBUS: length 15.9
  Top Layer w0.406: USB1.B4A9 47.4,7.76 47.21,7.57 47.21,7.25 46.4,6.44 43.73,6.44 42.79,7.38 42.79,7.57 42.6,7.76 USB1.A4B9 42.6,9.22 42.33,9.49 40.05,9.49 38.78,8.22 38.78,5.13 D1.2
BOOT: length 9.5
  Top Layer w0.254: boot.1 82.9,49.55 82.9,46.88 82.72,46.7 80.76,46.7 U1.60
  Bottom Layer w0.254: boot.1 83.24,49.35 R3.1
ENC_L_A: length 67.6
  Top Layer w0.254: U1.34 67.01,48.6 62.78,48.6 v1(62.02,47.84)
  Bottom Layer w0.254: v1(62.02,47.84) 62.02,44.54 58.72,41.24 58.72,38.19 42.46,21.93 29,21.93 25.44,25.49 23.53,25.49 left_encoder.2 21.5,23.63 21.5,21.17 20.62,20.28 R10.1
ENC_L_B: length 68.6
  Top Layer w0.254: U1.33 62.28,49.63 v1(62.02,49.37)
  Bottom Layer w0.254: v1(62.02,49.37) 61.13,48.48 61.13,45.17 57.83,41.87 57.83,38.44 42.08,22.7 29.51,22.7 24.09,28.11 left_encoder.3 23.11,27.78 21.76,27.78 20.22,26.24 R9.1
ENC_R_A: length 39.3
  Top Layer w0.254: U1.52 77.52,44.29 79.04,44.29 81.7,41.62 81.7,36.41 79.8,34.51 78.78,34.51 76.12,31.84 69.26,31.84 68.62,31.2 68.62,28.92 67.82,28.12 right_encoder.2
  Bottom Layer w0.305: R11.1 68.5,25.63 68.5,27.01 67.39,28.12 right_encoder.2
ENC_R_B: length 43.7
  Top Layer w0.254: right_encoder.3 64.56,27.52 64.56,31.33 65.57,32.35 75.86,32.35 78.53,35.02 79.67,35.02 80.69,36.03 80.69,36.79 81.19,37.3 81.19,41.36 78.78,43.78 77.32,43.78 U1.51
  Bottom Layer w0.305: right_encoder.3 66.88,25.58 68.37,24.09 68.37,23.35 R12.1
KEY0: length 71.8
  Top Layer w0.305: key0.2 9.98,61.27 13.63,57.62 21.25,57.62 24.04,60.42 33.32,60.42 37.13,56.61 50.08,56.61 54.02,52.67 62.15,52.67 64.05,54.57 64.05,57.11 65.07,58.13 65.57,58.13 66.21,57.49 66.21,57.01 U1.27
KEY1: length 67.7
  Top Layer w0.305: 69.43,54.49 66.84,57.08 66.84,58.51 66.08,59.27 64.56,59.27 63.16,57.88 63.16,54.83 62.02,53.68 54.4,53.68 50.46,57.62 37.76,57.62 33.82,61.56 23.79,61.56 20.62,58.38 17.69,58.38 16.93,59.14 16.93,62.11 key1.2
LE: length 74.9
  Top Layer w0.254: 29.51,7.96 29.08,7.96 29.03,8.02 U8.3 ; 29.51,7.96 30.14,7.96 30.32,8.15 U8.5 ; 29.51,7.96 29.68,8.13 U8.4 ; 29.51,7.96 29.51,7.33 v1(29.25,7.07) ; v1(64.43,45.94) 64.43,44.67 65.83,43.27 66.59,43.27 67.73,44.41 67.73,45.09 69.8,47.15
  Bottom Layer w0.254: v1(64.43,45.94) 59.35,40.86 59.35,37.94 42.71,21.3 32.55,21.3 29.63,18.38 29.63,15.2 30.46,14.38 30.46,8.28 v1(29.25,7.07)
LED0: length 59.6
  Top Layer w0.305: v1(18.84,59.53) 20.23,59.53 24.17,63.46 34.33,63.46 37.95,59.84 49.38,59.84 50.21,60.67 66.34,60.67 67.48,59.53 67.48,57.15 U1.25
  Bottom Layer w0.305: v1(18.84,59.53) 17.68,59.53 R4.2
LED1: length 59.5
  Top Layer w0.305: v1(18.46,61.81) 20.87,64.22 34.59,64.22 38.14,60.67 49.06,60.67 49.7,61.3 66.46,61.3 67.99,59.78 67.99,57.35 70.14,55.2
  Bottom Layer w0.305: v1(18.46,61.81) 18.33,61.69 R5.2
LED2: length 59.2
  Top Layer w0.305: U1.23 68.5,57.55 68.5,60.16 66.72,61.94 49.44,61.94 48.94,61.43 38.52,61.43 34.97,64.99 20.36,64.99 v1(19.47,64.1)
  Bottom Layer w0.305: v1(19.47,64.1) R6.2
LED3: length 6.4
  Top Layer w0.305: 76.08,56.97 77.11,58 v1(80.43,58)
  Bottom Layer w0.305: v1(80.43,58) 79.86,58 79.15,58.71
LED4: length 5.6
  Top Layer w0.305: U1.15 78.15,59.74 78.15,60.8 v1(78.91,61.56)
LED5: length 8.9
  Top Layer w0.305: v1(78.15,64.1) 77.69,64.1 77.26,63.67 77.26,60.45 75.37,58.56 U1.16
  Bottom Layer w0.305: 79.15,64.22 79.02,64.1 v1(78.15,64.1)
LS_RESET: length 34.5
  Top Layer w0.305: U1.17 71.03,59.25 71.03,62.19 69.13,64.1 48.68,64.1 46.78,66 44.87,66 44.5,65.63 line_sensor.4
LS_SCL: length 32.7
  Top Layer w0.305: line_sensor.2 45.5,63.47 46.02,62.95 47.29,62.95 47.67,63.34 68.88,63.34 70.15,62.07 70.15,58.02 71.55,56.61
LS_SDA: length 33.3
  Top Layer w0.305: line_sensor.3 45,62.83 45.51,62.32 47.67,62.32 48.05,62.7 68.62,62.7 69.64,61.69 69.64,57.82 U1.21
MLA: length 12
  Top Layer w0.508: U8.9 U8.26 23.74,10.2 motor_left.1
  Bottom Layer w0.508: motor_left.1 20.12,9.46 C76.2
MLB: length 11.7
  Top Layer w0.508: U8.11 U8.24 motor_left.2
  Bottom Layer w0.508: C77.2 22.97,12.03 motor_left.2
MLC: length 12
  Top Layer w0.508: U8.13 U8.22 23.74,13.8 motor_left.3
  Bottom Layer w0.508: motor_left.3 20.12,14.54 C78.2
MRA: length 12.2
  Top Layer w0.508: U9.9 U9.26 64.55,13.8 65.32,14.57 66.97,14.57 motor_right.1
  Bottom Layer w0.508: motor_right.1 69.94,14.54 C79.2
MRB: length 11.9
  Top Layer w0.508: U9.11 U9.24 motor_right.2
  Bottom Layer w0.508: C80.2 70.02,12 motor_right.2
MRC: length 12.2
  Top Layer w0.508: U9.13 U9.22 64.1,10.2 64.84,9.46 motor_right.3
  Bottom Layer w0.508: motor_right.3 70.01,9.46 C81.2
PLA: length 66.1
  Top Layer w0.254: v1(30.4,7.07) 30.97,7.66 U8.6 ; v1(65.45,45.94) 66.46,45.94 U1.37
  Bottom Layer w0.254: v1(65.45,45.94) 59.86,40.35 59.86,37.3 43.22,20.66 32.68,20.66 31.03,19.01 31.03,7.71 v1(30.4,7.07)
PLB: length 66.4
  Top Layer w0.254: U8.7 31.62,7.03 v1(31.28,6.69) ; U1.38 66.28,45.05 v1(65.57,45.05)
  Bottom Layer w0.254: v1(65.57,45.05) 65.57,45.17 60.49,40.09 60.49,36.79 43.73,20.03 32.81,20.03 31.66,18.89 31.66,7.07 v1(31.28,6.69)
PLC: length 65.8
  Top Layer w0.254: v1(32.55,6.82) 32.28,7.1 U8.8 ; U1.39 66.21,44.27 v1(66.21,44.03)
  Bottom Layer w0.254: v1(32.55,6.82) 32.55,7.33 32.3,7.58 32.3,18.63 33.06,19.39 43.98,19.39 61.13,36.54 61.13,39.84 65.64,44.35 65.89,44.35 v1(66.21,44.03)
PRA: length 48.2
  Top Layer w0.254: v1(75.73,48.48) 77.57,48.48 U1.58 ; U9.6 59.03,16.91 60.11,18 v1(60.11,18.12)
  Bottom Layer w0.254: v1(75.73,48.48) 74.72,49.49 72.56,49.49 68.37,45.3 68.37,35.14 64.56,31.33 64.56,20.54 63.03,19.01 61,19.01 v1(60.11,18.12)
PRB: length 50.1
  Top Layer w0.254: U9.7 58.38,17.28 58.84,17.74 v1(58.84,18.76) ; U1.59 77.38,49.37 v1(76.24,49.37)
  Bottom Layer w0.254: v1(58.84,18.76) 59.73,19.65 62.53,19.65 63.92,21.05 63.92,31.59 67.86,35.52 67.86,45.68 72.18,50 75.61,50 v1(76.24,49.37)
PRC: length 52.1
  Top Layer w0.254: U9.8 57.72,18.99 v1(57.7,19.01) ; 79.61,48.55 77.66,50.51 v1(76.62,50.51)
  Bottom Layer w0.254: v1(76.62,50.51) 76.5,50.64 71.92,50.64 67.35,46.06 67.35,35.78 63.41,31.84 63.41,21.43 62.27,20.28 58.97,20.28 v1(57.7,19.01)
RE: length 62.3
  Top Layer w0.254: v1(60.88,17.62) 60.88,16.47 60.75,16.35 ; v1(76.75,51.53) 77.35,51.53 79.97,48.91
  Top Layer w0.406: U9.4 60.32,16.27 60.25,16.35 ; U9.3 60.97,16.12 60.75,16.35 60.25,16.35 ; 60.25,16.35 59.99,16.35 59.68,16.03 U9.5
  Bottom Layer w0.254: v1(76.75,51.53) 72.05,51.53 66.84,46.32 66.84,36.16 62.78,32.09 62.78,21.68 62.02,20.92 58.46,20.92 56.68,19.14 56.68,18.12 57.7,17.11 60.37,17.11 v1(60.88,17.62)
RESET: length 40.4
  Top Layer w0.254: v1(70.65,41.87) 70.27,41.49 70.27,40.48 72.56,38.19 v1(73.45,38.19) ; v1(71.42,35.02) 72.2,35.02 reset.2 ; v1(80.56,55.72) 79.78,55.72 U1.7
  Bottom Layer w0.254: R2.1 74.48,38.19 v1(73.45,38.19) ; R2.1 74.99,37.68 DEBUG.4 ; R2.1 74.72,36.4 C68.2 73.34,35.02 v1(71.42,35.02) ; v1(80.56,55.72) 78.15,53.3 78.15,49.87 75.73,47.46 75.23,47.46 73.96,48.73 72.56,48.73 70.65,46.83 v1(70.65,41.87)
SCL: length 42.3
  Top Layer w0.305: v1(46.02,19.9) 46.02,20.28 60.49,34.76 60.49,44.92 63.41,47.84 66.95,47.84 U1.35
  Bottom Layer w0.305: v1(46.02,19.9) 45.27,19.16 45.25,19.16 45,18.91 imu.P$13
SDA: length 41.5
  Top Layer w0.305: v1(47.16,19.65) 47.16,20.03 61.26,34.13 61.26,44.03 64.43,47.21 67.03,47.21 68.39,48.57
  Bottom Layer w0.305: v1(47.16,19.65) 46.92,19.65 imu.P$14
SPEAKER: length 5.6
  Top Layer w0.305: U1.22 71.92,54.83 v1(71.92,54.06)
  Bottom Layer w0.305: v1(71.92,54.06) 70.65,55.33 70.65,56.88
SWCLK: length 5.5
  Top Layer w0.254: DEBUG.8 74.72,43.02 74.72,43.66 U1.49
SWDIO: length 10.4
  Top Layer w0.254: 71.92,45.03 72.7,45.81 73.45,45.81 73.7,45.56 73.7,42.76 DEBUG.6
SWO: length 19.8
  Top Layer w0.254: 77.49,46.43 78.37,45.56 79.8,45.56 82.59,42.76 v1(82.59,38.06)
  Bottom Layer w0.254: v1(82.59,38.06) 82.59,36.41 81.19,35.02 77.89,35.02 77.51,35.4 DEBUG.2
TPWM: length 69.4
  Top Layer w0.305: U1.28 66.54,55.97 66.34,55.97 v1(65.19,57.11)
  Bottom Layer w0.305: v1(65.19,57.11) 64.56,57.11 64.05,56.61 64.05,54.83 62.02,52.8 51.99,52.8 50.97,53.81 34.97,53.81 26.33,45.17 26.33,37.17 25.19,36.03 19.07,36.03 Q1.1
  Bottom Layer w0.559: Q1.1 16.35,36.73 R17.2
UART_RX: length 17.5
  Top Layer w0.254: v1(74.08,46.83) 71.59,46.83 U1.43 ; DEBUG.3 79.29,37.68 80.62,39.02 80.62,41.05 78.4,43.27 v1(76.62,43.27)
  Bottom Layer w0.254: v1(74.08,46.83) 74.08,45.94 76.62,43.4 v1(76.62,43.27)
UART_TX: length 16.9
  Top Layer w0.254: U1.42 71.78,47.72 v1(73.19,47.72) ; DEBUG.5 79.42,38.95 79.93,39.46 79.93,40.86 78.4,42.38 v1(76.24,42.38)
  Bottom Layer w0.254: v1(76.24,42.38) 73.19,45.43 v1(73.19,47.72)
USB_DN: length 56.8
  Top Layer w0.254: USB1.A7 45.25,7.2 45,6.95 44.49,6.95 44.25,7.19 USB1.B7 44.25,9.63 v1(45.25,10.63) ; v1(64.81,42.32) 67.03,42.32 67.48,42.76 68.24,42.76 U1.44
  Bottom Layer w0.254: v1(64.81,42.32) 64.81,38.19 50.21,23.58 50.21,20.41 49.32,19.52 49.32,10.5 48.81,10 47.67,10 47.03,10.63 v1(45.25,10.63)
USB_DP: length 53.7
  Top Layer w0.254: 45.75,9.12 45.38,9.49 45,9.49 44.75,9.24 USB1.A6 ; 45.75,9.12 45.75,9.6 v1(46.14,10) ; 45.75,9.12 USB1.B6 ; v1(65.57,41.49) 66.97,41.49 67.73,42.25 68.44,42.25 71.57,45.39
  Bottom Layer w0.254: v1(65.57,41.49) 65.57,38.06 50.84,23.33 50.84,20.16 49.95,19.27 49.95,10 49.44,9.49 47.54,9.49 47.03,10 v1(46.14,10)
$1N2564: length 6
  Top Layer w0.305: U1.30 65.07,56.03 v1(65.07,56.1)
  Bottom Layer w0.305: C8.1 66.48,56.1 v1(65.07,56.1)
$1N3048: length 5.9
  Top Layer w0.305: v1(14.33,59.46) 14.9,60.03 14.9,63.84 U4.2
  Bottom Layer w0.305: v1(14.33,59.46) 15.49,59.46 R4.1
$1N3052: length 2.8
  Top Layer w0.305: v1(15.92,61.69) 16.14,61.9 U4.3
  Bottom Layer w0.305: v1(15.92,61.69) R5.1
$1N3056: length 2.3
  Top Layer w0.305: 16.14,64.58 15.79,64.92 v1(15.79,65.37)
  Bottom Layer w0.305: R6.1 15.79,64.34 v1(15.79,65.37)
$1N3098: length 6.2
  Top Layer w0.305: U5.2 73.83,63.71 73.83,63.08 v1(75.35,61.56)
  Bottom Layer w0.305: 77.15,58.89 77.15,59.76 v1(75.35,61.56)
$1N3100: length 3
  Top Layer w0.305: U5.3 75.06,63.47 v1(75.84,62.7)
  Bottom Layer w0.305: R14.1 76.73,61.81 v1(75.84,62.7)
$1N3102: length 2.2
  Top Layer w0.305: v1(75.61,64.35) 75.51,64.45 U5.4
  Bottom Layer w0.305: 77.15,64.22 77.02,64.35 v1(75.61,64.35)
$1N7269: length 18.7
  Top Layer w0.305: U18.1 79.54,64.35 78.4,65.5 69.76,65.5 v1(69.13,64.86)
  Bottom Layer w0.305: v1(69.13,64.86) 69.13,63.77 70.65,62.25 70.65,58.88
$1N8342: length 10.1
  Top Layer w0.254: U1.6 79.72,54.95 81.07,54.95 82.21,56.1 84.75,56.1 ; 84.75,56.1 84.62,56.22 v1(84.62,56.48) ; 84.75,56.1 X1.1
  Bottom Layer w0.254: C83.2 85.5,55.6 v1(84.62,56.48)
$1N8350: length 13.7
  Top Layer w0.254: U1.5 79.92,54.45 83.74,54.45 84.5,53.68 84.5,51.78 84.88,51.4 86.07,51.4 X1.3 87.51,52.58 v1(88.05,52.03)
  Bottom Layer w0.254: v1(88.05,52.03) 87.7,52.38 C82.2
$2N181: length 6.8
  Bottom Layer w0.559: Q1.3 21.25,37.68 turbine.1 21.87,40.62 R16.1
$2N2777: length 3.8
  Top Layer w0.406: U8.21 26,16.62 C13.1
$2N2783: length 3.3
  Top Layer w0.406: U8.20 28.38,17.62 C13.2
$2N2790: length 6
  Top Layer w0.406: C14.2 36,17.25 34.97,16.22 32.68,16.22 32.28,15.81 U8.14
$2N2949: length 3.9
  Top Layer w0.406: C15.2 31,17.71 29.03,15.74 U8.19
$2N3549: length 4.5
  Top Layer w0.406: C19.1 65,7.65 64.18,8.47 62.9,8.47 U9.21
$2N3553: length 3.2
  Top Layer w0.406: U9.20 61.62,8.48 63,7.11 C19.2
$2N3557: length 2.9
  Top Layer w0.406: U9.14 57.72,8.5 56.23,7 ; 56.23,6.49 C20.2
$2N3560: length 2.6
  Top Layer w0.406: C21.2 60.97,6.52 U9.19
$3N897: length 3.3
  Top Layer w0.508: C62.2 18.13,47.65 U16.6
$3N898: length 9.9
  Top Layer w0.508: C62.1 18.44,45.3 17.19,45.3 15.79,46.7 U16.5 14.65,46.7 14.14,47.21 14.14,48.86 15.77,50.48 L1.1
$3N1728: length 2.9
  Top Layer w0.406: R1.1 U17.2
$3N2192: length 5.7
  Top Layer w0.254: v1(46.78,9.36) 46.75,9.33 USB1.B5
  Bottom Layer w0.254: v1(46.78,9.36) 46.78,5.78 R7.1
$3N2197: length 7.2
  Top Layer w0.254: USB1.A5 43.75,9.47 v1(43.22,10)
  Bottom Layer w0.254: v1(43.22,10) 43.22,5.78 R8.1

## Copper pours and planes (outline as drawn; the poured copper is in the pictures)
GND on Top Layer: -2.5,75.02 93.26,75.02 93.26,-31.66 -2.5,-31.66
GND on Bottom Layer: -5.04,76.42 93.39,76.42 93.39,-28.49 -5.04,-28.49
GND on Inner1: -8.34,78.19 96.56,78.19 96.56,-12.74 -8.34,-12.74

## Text on the board
Top Silkscreen Layer: + | - | B | A | C
